# Altium schematic sheet 10-DPLL-1.SchDoc
size C; SheetNumber: 9; SheetTotal: 15
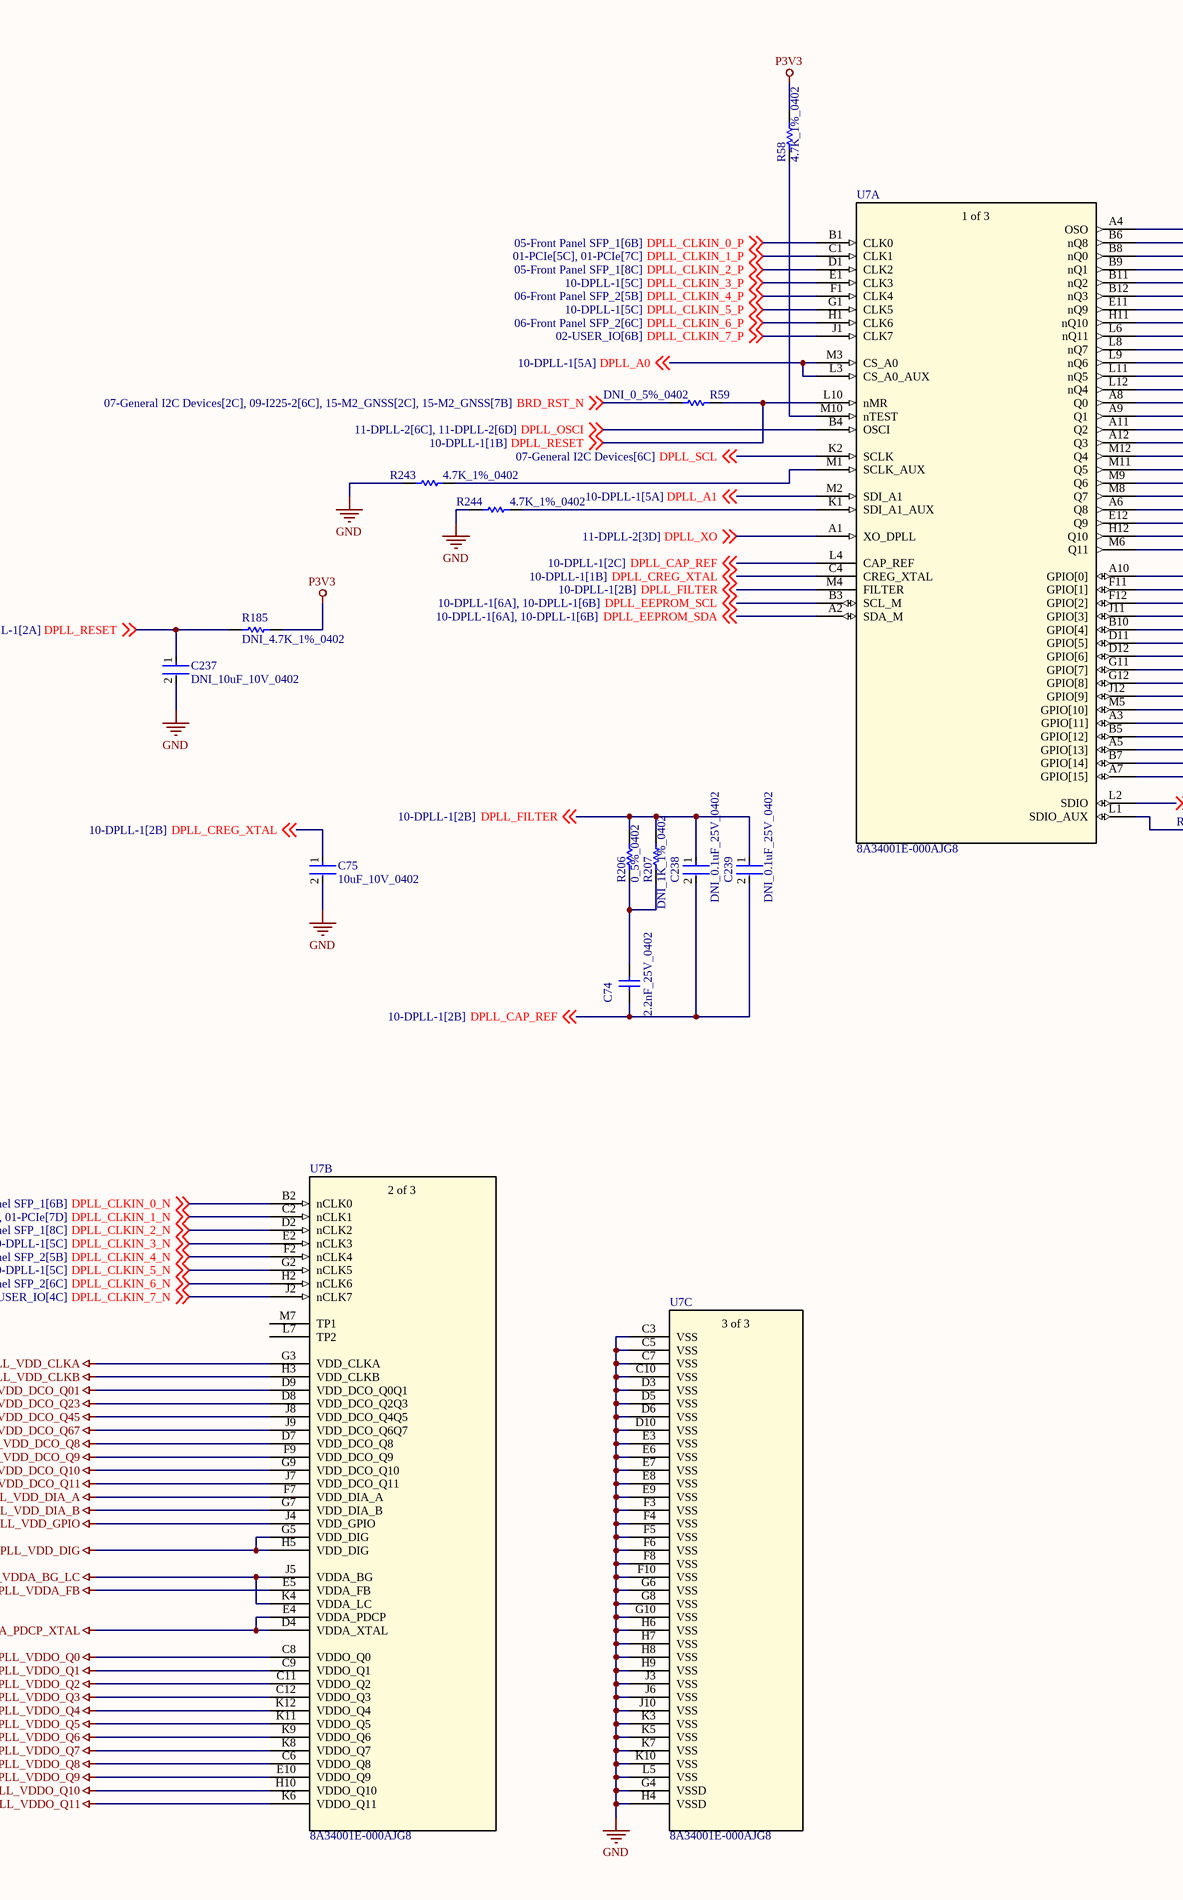
[diagram p0: 10-DPLL-1.SchDoc, left]
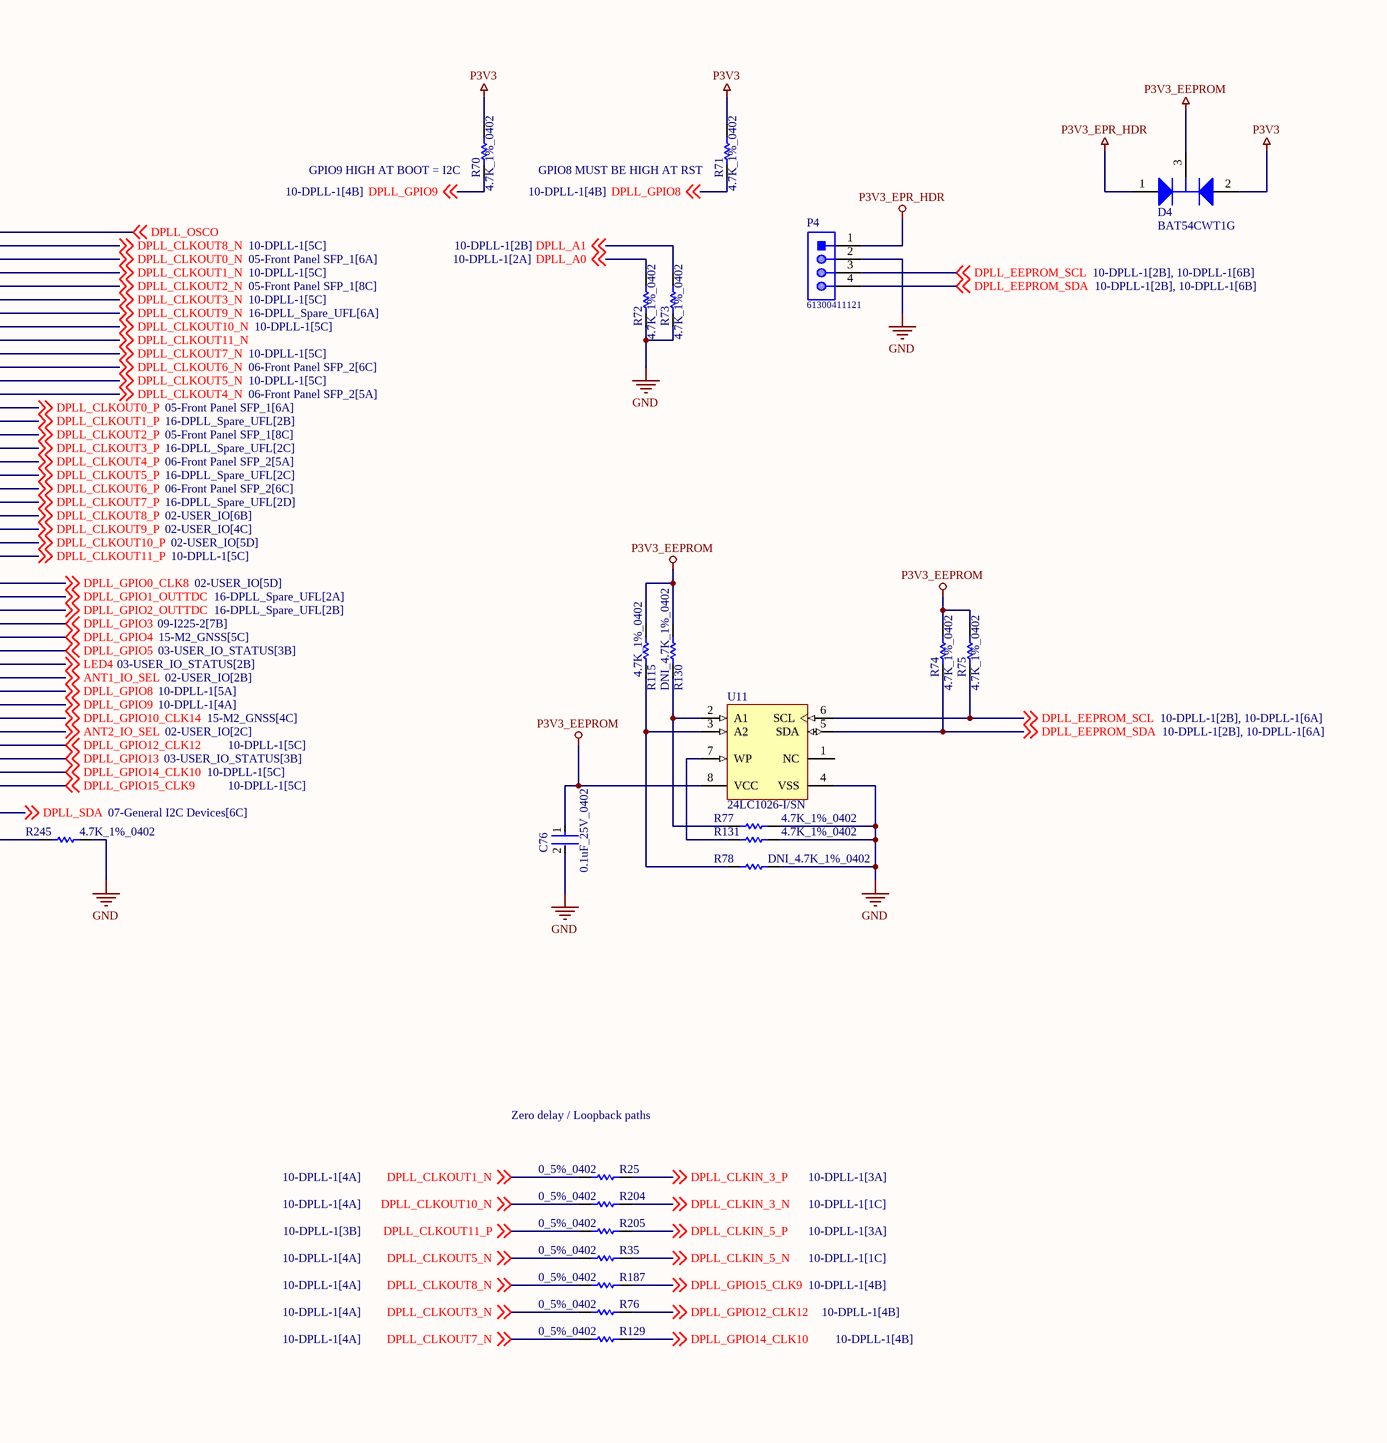
[diagram p1: 10-DPLL-1.SchDoc, right]

## Parts
C74  2.2nF_25V_0402  [CAPC1005X56X25LL10T15]
C75  10uF_10V_0402  [FP-CL05A106MP5NUNC-MFG]
C76  0.1uF_25V_0402  [FP-0402-L_1_0_1-W_0_5_0_1-IPC_C]
C237  DNI_10uF_10V_0402  [FP-CL05A106MP5NUNC-MFG]  (no BOM)
C238  DNI_0.1uF_25V_0402  [FP-0402-L_1_0_1-W_0_5_0_1-IPC_C]  (no BOM)
C239  DNI_0.1uF_25V_0402  [FP-0402-L_1_0_1-W_0_5_0_1-IPC_C]  (no BOM)
D4  BAT54CWT1G  [ONSC-SOT-323-3-419-04_V]
P4  61300411121  [61300411121]
R25  0_5%_0402  [RESC1005X40X25LL10T10]
R35  0_5%_0402  [RESC1005X40X25LL10T10]
R58  4.7K_1%_0402  [RESC1005X40X25NL10T10]
R59  DNI_0_5%_0402  [RESC1005X40X25LL10T10]  (no BOM)
R70  4.7K_1%_0402  [RESC1005X40X25NL10T10]
R71  4.7K_1%_0402  [RESC1005X40X25NL10T10]
R72  4.7K_1%_0402  [RESC1005X40X25NL10T10]
R73  4.7K_1%_0402  [RESC1005X40X25NL10T10]
R74  4.7K_1%_0402  [RESC1005X40X25NL10T10]
R75  4.7K_1%_0402  [RESC1005X40X25NL10T10]
R76  0_5%_0402  [RESC1005X40X25LL10T10]
R77  4.7K_1%_0402  [RESC1005X40X25NL10T10]
R78  DNI_4.7K_1%_0402  [RESC1005X40X25NL10T10]  (no BOM)
R115  4.7K_1%_0402  [RESC1005X40X25NL10T10]
R129  0_5%_0402  [RESC1005X40X25LL10T10]
R130  DNI_4.7K_1%_0402  [RESC1005X40X25NL10T10]  (no BOM)
R131  4.7K_1%_0402  [RESC1005X40X25NL10T10]
R185  DNI_4.7K_1%_0402  [RESC1005X40X25NL10T10]  (no BOM)
R187  0_5%_0402  [RESC1005X40X25LL10T10]
R204  0_5%_0402  [RESC1005X40X25LL10T10]
R205  0_5%_0402  [RESC1005X40X25LL10T10]
R206  0_5%_0402  [RESC1005X40X25LL10T10]
R207  DNI_1K_1%_0402  [RESC1005X40X25NL05T05]  (no BOM)
R243  4.7K_1%_0402  [RESC1005X40X25NL10T10]
R244  4.7K_1%_0402  [RESC1005X40X25NL10T10]
R245  4.7K_1%_0402  [RESC1005X40X25NL10T10]
U7  8A34001E-000AJG8  [144-CABGA_REN]  (parts A,B,C of 3)
U11  24LC1026-I/SN  [MCHP-SOIC-SN8_N]

## Nets
DPLL_VDD_CLKA: U7.G3(VDD_CLKA)
DPLL_VDD_CLKB: U7.H3(VDD_CLKB)
DPLL_VDD_DCO_Q01: U7.D9(VDD_DCO_Q0Q1)
DPLL_VDD_DCO_Q8: U7.D7(VDD_DCO_Q8)
DPLL_VDD_DCO_Q9: U7.F9(VDD_DCO_Q9)
DPLL_VDD_DCO_Q10: U7.G9(VDD_DCO_Q10)
DPLL_VDD_DCO_Q11: U7.J7(VDD_DCO_Q11)
DPLL_VDD_DCO_Q23: U7.D8(VDD_DCO_Q2Q3)
DPLL_VDD_DCO_Q45: U7.J8(VDD_DCO_Q4Q5)
DPLL_VDD_DCO_Q67: U7.J9(VDD_DCO_Q6Q7)
DPLL_VDD_DIA_A: U7.F7(VDD_DIA_A)
DPLL_VDD_DIA_B: U7.G7(VDD_DIA_B)
DPLL_VDD_DIG: U7.G5(VDD_DIG) U7.H5(VDD_DIG)
DPLL_VDD_GPIO: U7.J4(VDD_GPIO)
DPLL_VDDA_BG_LC: U7.J5(VDDA_BG) U7.K4(VDDA_LC)
DPLL_VDDA_FB: U7.E5(VDDA_FB)
DPLL_VDDA_PDCP_XTAL: U7.D4(VDDA_XTAL) U7.E4(VDDA_PDCP)
DPLL_VDDO_Q0: U7.C8(VDDO_Q0)
DPLL_VDDO_Q1: U7.C9(VDDO_Q1)
DPLL_VDDO_Q2: U7.C11(VDDO_Q2)
DPLL_VDDO_Q3: U7.C12(VDDO_Q3)
DPLL_VDDO_Q4: U7.K12(VDDO_Q4)
DPLL_VDDO_Q5: U7.K11(VDDO_Q5)
DPLL_VDDO_Q6: U7.K9(VDDO_Q6)
DPLL_VDDO_Q7: U7.K8(VDDO_Q7)
DPLL_VDDO_Q8: U7.C6(VDDO_Q8)
DPLL_VDDO_Q9: U7.E10(VDDO_Q9)
DPLL_VDDO_Q10: U7.H10(VDDO_Q10)
DPLL_VDDO_Q11: U7.K6(VDDO_Q11)
GND: C75.2 C76.2 C237.2 P4.2 R72.2 R73.2 R77.1 R78.2 R131.1 R243.2 R244.2 R245.1 U7.C3(VSS) U7.C5(VSS) U7.C7(VSS) U7.C10(VSS) U7.D3(VSS) U7.D5(VSS) U7.D6(VSS) U7.D10(VSS) U7.E3(VSS) U7.E6(VSS) U7.E7(VSS) U7.E8(VSS) U7.E9(VSS) U7.F3(VSS) U7.F4(VSS) U7.F5(VSS) U7.F6(VSS) U7.F8(VSS) U7.F10(VSS) U7.G4(VSSD) U7.G6(VSS) U7.G8(VSS) U7.G10(VSS) U7.H4(VSSD) U7.H6(VSS) U7.H7(VSS) U7.H8(VSS) U7.H9(VSS) U7.J3(VSS) U7.J6(VSS) U7.J10(VSS) U7.K3(VSS) U7.K5(VSS) U7.K7(VSS) U7.K10(VSS) U7.L5(VSS) U11.4(VSS)
P3V3: D4.2(A2) R58.2 R70.1 R71.1 R185.1
P3V3_EEPROM: C76.1 D4.3(K) R74.1 R75.1 R115.2 R130.2 U11.8(VCC)
P3V3_EPR_HDR: D4.1(A1) P4.1
ANT1_IO_SEL: U7.G11(GPIO[7]) ; off-sheet ANT1_IO_SEL
ANT2_IO_SEL: U7.A3(GPIO[11]) ; off-sheet ANT2_IO_SEL
BRD_RST_N: R59.1 ; off-sheet BRD_RST_N
DPLL_A0: R72.1 U7.L3(CS_A0_AUX) U7.M3(CS_A0) ; off-sheet DPLL_A0
DPLL_A1: R73.1 U7.M2(SDI_A1) ; off-sheet DPLL_A1
DPLL_CAP_REF: C74.1 C238.2 C239.2 U7.L4(CAP_REF) ; off-sheet DPLL_CAP_REF
DPLL_CLKIN_0_N: U7.B2(nCLK0) ; off-sheet DPLL_CLKIN_0_N
DPLL_CLKIN_0_P: U7.B1(CLK0) ; off-sheet DPLL_CLKIN_0_P
DPLL_CLKIN_1_N: U7.C2(nCLK1) ; off-sheet DPLL_CLKIN_1_N
DPLL_CLKIN_1_P: U7.C1(CLK1) ; off-sheet DPLL_CLKIN_1_P
DPLL_CLKIN_2_N: U7.D2(nCLK2) ; off-sheet DPLL_CLKIN_2_N
DPLL_CLKIN_2_P: U7.D1(CLK2) ; off-sheet DPLL_CLKIN_2_P
DPLL_CLKIN_3_N: R204.2 U7.E2(nCLK3) ; off-sheet DPLL_CLKIN_3_N
DPLL_CLKIN_3_P: R25.2 U7.E1(CLK3) ; off-sheet DPLL_CLKIN_3_P
DPLL_CLKIN_4_N: U7.F2(nCLK4) ; off-sheet DPLL_CLKIN_4_N
DPLL_CLKIN_4_P: U7.F1(CLK4) ; off-sheet DPLL_CLKIN_4_P
DPLL_CLKIN_5_N: R35.2 U7.G2(nCLK5) ; off-sheet DPLL_CLKIN_5_N
DPLL_CLKIN_5_P: R205.2 U7.G1(CLK5) ; off-sheet DPLL_CLKIN_5_P
DPLL_CLKIN_6_N: U7.H2(nCLK6) ; off-sheet DPLL_CLKIN_6_N
DPLL_CLKIN_6_P: U7.H1(CLK6) ; off-sheet DPLL_CLKIN_6_P
DPLL_CLKIN_7_N: U7.J2(nCLK7) ; off-sheet DPLL_CLKIN_7_N
DPLL_CLKIN_7_P: U7.J1(CLK7) ; off-sheet DPLL_CLKIN_7_P
DPLL_CLKOUT0_N: U7.B8(nQ0) ; off-sheet DPLL_CLKOUT0_N
DPLL_CLKOUT0_P: U7.A8(Q0) ; off-sheet DPLL_CLKOUT0_P
DPLL_CLKOUT1_N: R25.1 U7.B9(nQ1) ; off-sheet DPLL_CLKOUT1_N
DPLL_CLKOUT1_P: U7.A9(Q1) ; off-sheet DPLL_CLKOUT1_P
DPLL_CLKOUT2_N: U7.B11(nQ2) ; off-sheet DPLL_CLKOUT2_N
DPLL_CLKOUT2_P: U7.A11(Q2) ; off-sheet DPLL_CLKOUT2_P
DPLL_CLKOUT3_N: R76.1 U7.B12(nQ3) ; off-sheet DPLL_CLKOUT3_N
DPLL_CLKOUT3_P: U7.A12(Q3) ; off-sheet DPLL_CLKOUT3_P
DPLL_CLKOUT4_N: U7.L12(nQ4) ; off-sheet DPLL_CLKOUT4_N
DPLL_CLKOUT4_P: U7.M12(Q4) ; off-sheet DPLL_CLKOUT4_P
DPLL_CLKOUT5_N: R35.1 U7.L11(nQ5) ; off-sheet DPLL_CLKOUT5_N
DPLL_CLKOUT5_P: U7.M11(Q5) ; off-sheet DPLL_CLKOUT5_P
DPLL_CLKOUT6_N: U7.L9(nQ6) ; off-sheet DPLL_CLKOUT6_N
DPLL_CLKOUT6_P: U7.M9(Q6) ; off-sheet DPLL_CLKOUT6_P
DPLL_CLKOUT7_N: R129.1 U7.L8(nQ7) ; off-sheet DPLL_CLKOUT7_N
DPLL_CLKOUT7_P: U7.M8(Q7) ; off-sheet DPLL_CLKOUT7_P
DPLL_CLKOUT8_N: R187.1 U7.B6(nQ8) ; off-sheet DPLL_CLKOUT8_N
DPLL_CLKOUT8_P: U7.A6(Q8) ; off-sheet DPLL_CLKOUT8_P
DPLL_CLKOUT9_N: U7.E11(nQ9) ; off-sheet DPLL_CLKOUT9_N
DPLL_CLKOUT9_P: U7.E12(Q9) ; off-sheet DPLL_CLKOUT9_P
DPLL_CLKOUT10_N: R204.1 U7.H11(nQ10) ; off-sheet DPLL_CLKOUT10_N
DPLL_CLKOUT10_P: U7.H12(Q10) ; off-sheet DPLL_CLKOUT10_P
DPLL_CLKOUT11_N: U7.L6(nQ11) ; off-sheet DPLL_CLKOUT11_N
DPLL_CLKOUT11_P: R205.1 U7.M6(Q11) ; off-sheet DPLL_CLKOUT11_P
DPLL_CREG_XTAL: C75.1 U7.C4(CREG_XTAL) ; off-sheet DPLL_CREG_XTAL
DPLL_EEPROM_SCL: P4.3 R75.2 U7.B3(SCL_M) U11.6(SCL) ; off-sheet DPLL_EEPROM_SCL
DPLL_EEPROM_SDA: P4.4 R74.2 U7.A2(SDA_M) U11.5(SDA) ; off-sheet DPLL_EEPROM_SDA
DPLL_FILTER: C238.1 C239.1 R206.2 R207.2 U7.M4(FILTER) ; off-sheet DPLL_FILTER
DPLL_GPIO0_CLK8: U7.A10(GPIO[0]) ; off-sheet DPLL_GPIO0_CLK8
DPLL_GPIO1_OUTTDC: U7.F11(GPIO[1]) ; off-sheet DPLL_GPIO1_OUTTDC
DPLL_GPIO2_OUTTDC: U7.F12(GPIO[2]) ; off-sheet DPLL_GPIO2_OUTTDC
DPLL_GPIO3: U7.J11(GPIO[3]) ; off-sheet DPLL_GPIO3
DPLL_GPIO4: U7.B10(GPIO[4]) ; off-sheet DPLL_GPIO4
DPLL_GPIO5: U7.D11(GPIO[5]) ; off-sheet DPLL_GPIO5
DPLL_GPIO8: R71.2 U7.G12(GPIO[8]) ; off-sheet DPLL_GPIO8
DPLL_GPIO9: R70.2 U7.J12(GPIO[9]) ; off-sheet DPLL_GPIO9
DPLL_GPIO10_CLK14: U7.M5(GPIO[10]) ; off-sheet DPLL_GPIO10_CLK14
DPLL_GPIO12_CLK12: R76.2 U7.B5(GPIO[12]) ; off-sheet DPLL_GPIO12_CLK12
DPLL_GPIO13: U7.A5(GPIO[13]) ; off-sheet DPLL_GPIO13
DPLL_GPIO14_CLK10: R129.2 U7.B7(GPIO[14]) ; off-sheet DPLL_GPIO14_CLK10
DPLL_GPIO15_CLK9: R187.2 U7.A7(GPIO[15]) ; off-sheet DPLL_GPIO15_CLK9
DPLL_OSCI: U7.B4(OSCI) ; off-sheet DPLL_OSCI
DPLL_OSCO: U7.A4(OSO) ; off-sheet DPLL_OSCO
DPLL_RESET: C237.1 R59.2 R185.2 U7.L10(nMR) ; off-sheet DPLL_RESET
DPLL_SCL: U7.K2(SCLK) ; off-sheet DPLL_SCL
DPLL_SDA: U7.L2(SDIO) ; off-sheet DPLL_SDA
DPLL_XO: U7.A1(XO_DPLL) ; off-sheet DPLL_XO
LED4: U7.D12(GPIO[6]) ; off-sheet LED4
NetC74_2: C74.2 R206.1 R207.1
NetR58_1: R58.1 U7.M10(nTEST)
NetR77_2: R77.2 R130.1 U11.2(A1)
NetR78_1: R78.1 R115.1 U11.3(A2)
NetR131_2: R131.2 U11.7(WP)
NetR243_1: R243.1 U7.M1(SCLK_AUX)
NetR244_1: R244.1 U7.K1(SDI_A1_AUX)
NetR245_2: R245.2 U7.L1(SDIO_AUX)

Not connected (* = marked no-connect by the designer): U7 L7(TP2) M7(TP1); U11 1(NC)

## Notes on the sheet
- (near R70) GPIO9 HIGH AT BOOT = I2C
- GPIO8 MUST BE HIGH AT RST
- Zero delay / Loopback paths
- (in symbol 8A34001E-000AJG8, part A) 1 of 3
- (in symbol 8A34001E-000AJG8, part B) 2 of 3
- (in symbol 8A34001E-000AJG8, part C) 3 of 3

## Library data of the parts
C74 = CMP-2008-02907-1: Manufacturer: AVX Interconnect / Elco; Part Number: 04025C222JAT2A
C75 C237 = CMP-13271-000002-1: CAP CER 10UF 10V X5R 0402; Manufacturer Part Number: CL05A106MP5NUNC; Manufacturer: Samsung; Temperature Coefficient: 15%; Tolerance: 20%; Material: Ceramic; Octopart: https://octopart.com/cl05a106mp5nunc-samsung-22457395; Voltage Rating: 10V; RoHS: TRUE; Value: 10uF; Height: 0.7mm; Digikey Description: CAP CER 10UF 10V X5R 0402; Automotive: No; Package: CL05A106MP5NUNC; Device Class L1: Passive Components; Capacitance: 10uF; Temperature Range High: +85°C; ComponentLink2Description: Datasheet; Device Class L2: Capacitors; Temperature Characteristic: X5R; Temperature: -55°C to +85°C; ComponentLink2URL: http://www.samsungsem.com/kr/support/product-search/mlcc/__icsFiles/afieldfile/2019/05/10/19-CL05A106MP5NUNC.pdf; Device Class L3: Ceramic Capacitors; Category: Cap; Temperature Range Low: -55°C; Ipc Land Pattern Name: CAPC10050X50; Lead Free: Yes
C76 C238 C239 = CMP-2008-02519-2: General Purpose Ceramic Capacitor, 0402, 100nF, 10%, X7R, 15%, 25V; Package Quantity: 1; Capacitance: 100nF; Min Operating Temperature: -55°C; Voltage: 25V; Voltage Rating: 25V; Construction: Flat; Max Operating Temperature: 125°C; Radiation Hardening: No; Depth: 0.5mm; Thickness: 0.022inch; Voltage Rating (DC): 25V; Number of Pins: 2; Lead Free: Lead Free; Series: -; REACH SVHC: No SVHC; Length: 1mm; Dielectric: X7R; RoHS Compliant: Yes; Mount: Surface Mount; Packaging: Tape and Reel; Case/Package: 0402; Case Code (Imperial): 0402; Termination: SMD/SMT; Width: 0.02inch; Case Code (Metric): 1005; Tolerance: 10%
D4 = CMP-1055-00557-1: Dual Series Cathode Schottky Barrier Diodes, 3-Pin SOT-323, Pb-Free, Tape and Reel; Manufacturer: On Semiconductor; Configuration: Common Cathode; IFSM Max (A): 0.6; trr Max (ns): 5; ComponentLink2Description: Datasheet; Packing: Tape and Reel; ComponentLink3Description: Package Specification; Mounting Technology: Surface Mount; PartNumber: BAT54CWT1G; PackageVersion: Rev. N, 11/2008; RoHS: TRUE; ComponentLink3URL: http://www.onsemi.com/pub_link/Collateral/419-04.PDF; ComponentLink2URL: http://www.onsemi.cn/pub_link/Collateral/BAT54CWT1-D.PDF; PackageReference: SOT-323-3-419-04; ComponentLink1URL: http://www.onsemi.com/; ComponentLink1Description: Manufacturer URL; DatasheetVersion: Rev. 7; PackageDescription: 3-Pin Small Outline Transistor, Body 2 x 1.25 mm, Pitch 0.65 mm
P4 = CMP-1502-01064-1: THT Vertical Pin Header WR-PHD, Pitch 2.54 mm, Single Row, 4 pins; Manufacturer: Wurth Elektronik; Withstanding Voltage: 500VAC; Rated Current: 3A; Working Voltage: 250VAC; Pin Number: 4; Gender: Male; Contact Resistance: 20mOhm; Pitch: 2.54mm; Manufacturer URL: http://www.we-online.de; Operating Temperature: -40to105degC; Packaging: Bag; Mounting Technology: THT; Package Reference: 61300411121; Datasheet URL: https://katalog.we-online.de/em/datasheet/6130xx11121.pdf; Publisher: WurthElektronik; Part Number: 61300411121; Row Number: Single; Orientation: Vertical
R25 R35 R59 R76 R129 R187 R204-R206 = CMP-2002-04569-1: Manufacturer: KOA Speer; Part Number: RK73Z1ETTP
R58 R70-R75 R77 R78 R115 R130 R131 R185 R243-R245 = CMP-2002-05217-1: Manufacturer: Bourns; Part Number: CR0402-FX-4701GLF
R207 = CMP-2002-08277-1: Manufacturer: Vishay Dale; Part Number: CRCW04021K00FKTD
U7 = 8A34001E-000AJG8: No Description Available; Mfr_Name: Renesas Electronics; Copyright: Copyright (C) 2024 Ultra Librarian. All rights reserved.; Manufacturer_Part_Number: 8A34001E-000AJG8; RefDes: RefDes; Type: DEV
U11 = CMP-0159-01024-1: 1024K bits I2C™ Serial EEPROM, 2.5 to 5.5 V, 400 kHz, -40 to 85 degC, 8-pin SOIC (SN8), Tube; Manufacturer: Microchip; DatasheetVersion: Rev. C; ComponentLink3Description: Package Specification; ComponentLink1URL: http://www.microchip.com; Mounting Technology: Surface Mount; ComponentLink4URL: http://www.microchip.com/24LC1026; ComponentLink2Description: Datasheet; PartNumber: 24LC1026-I/SN; PackageReference: SOIC-SN8; PackageDescription: 8-Lead Plastic Small Outline, 4.9 x 3.9 mm Body, 1.27 mm Pitch; ComponentLink1Description: Manufacturer URL; ComponentLink3URL: http://www.microchip.com/stellent/groups/techpub_sg/documents/packagingspec/en012702.pdf; ComponentLink2URL: http://ww1.microchip.com/downloads/en/DeviceDoc/22270C.pdf; PackageVersion: C04-057C; ComponentLink4Description: Product URL